# Altium schematic sheet Backplane.SchDoc
size A3
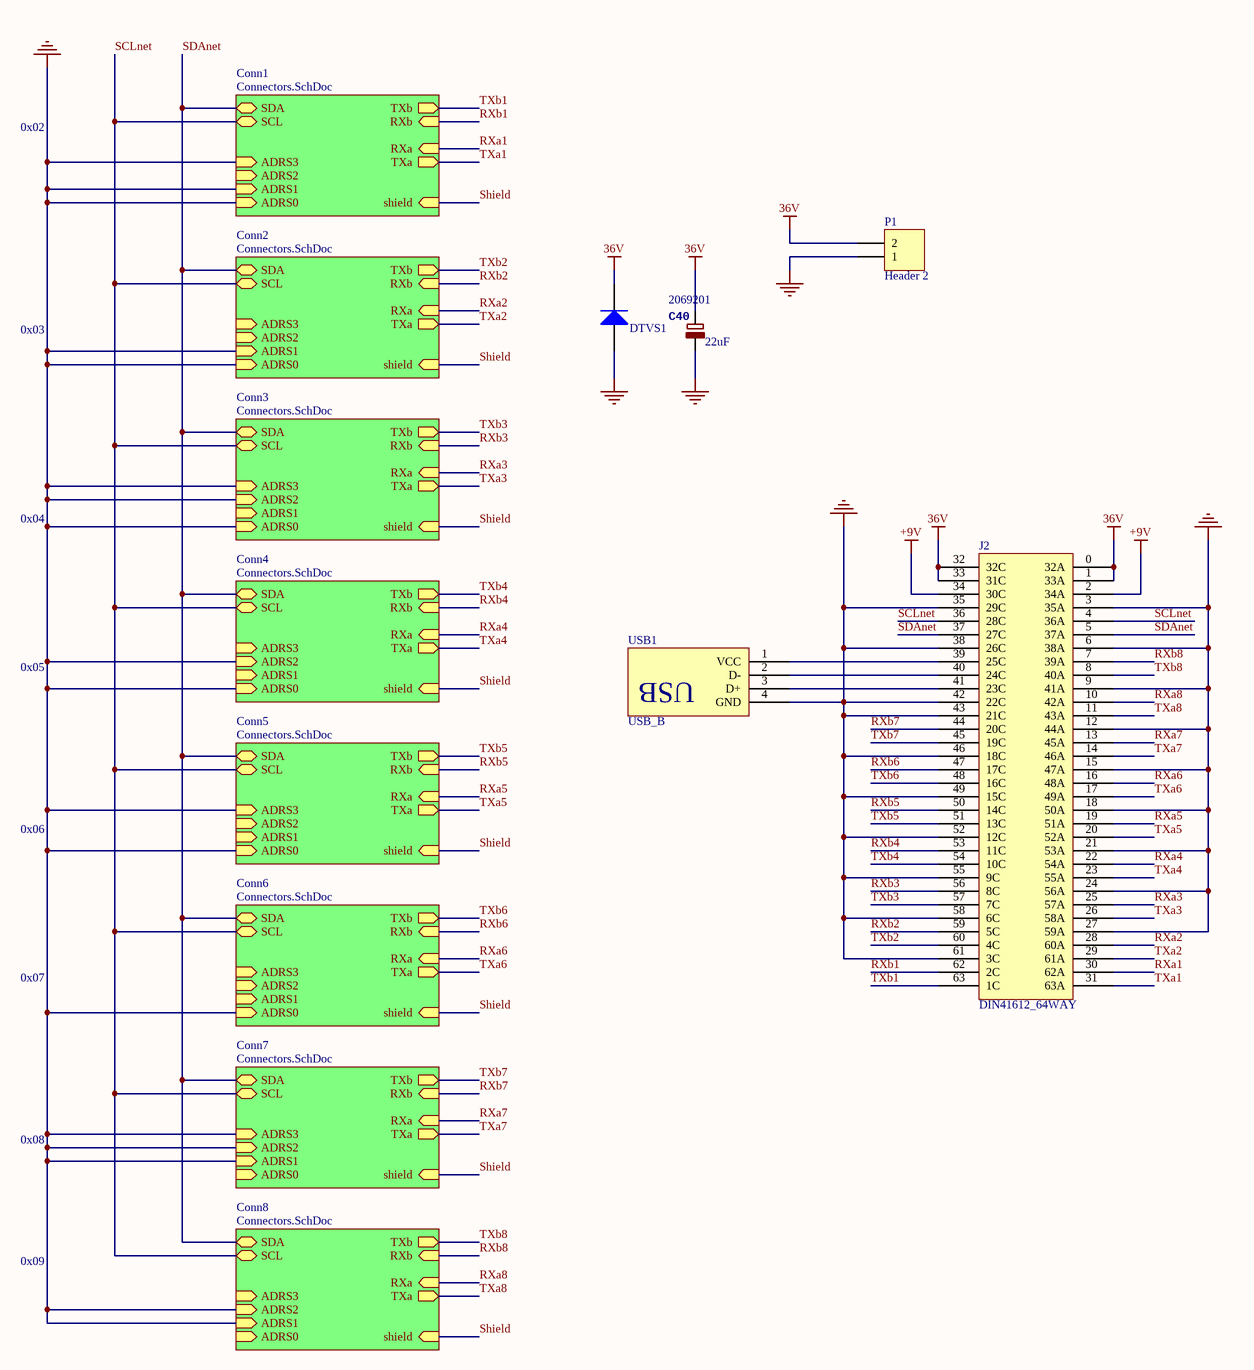
[diagram p0: Backplane.SchDoc]

## Parts
C40  value 22uF  Supplier Part Number 1: 2069201  [PANASONIC_D]
DTVS1  SMBJ36A  [SMBJ]  (value not drawn)
J2  DIN41612_64WAY  [09 03 164 6919]
P1  Header 2  [8PCV]
USB1  USB_B  [USB_B_VERTICAL]

## Sub-sheets
Conn1 = Connectors.SchDoc: SDA (bidir), SCL (bidir), RXb (in), TXb (out), RXa (in), TXa (out), ADRS3 (in), ADRS2 (in), ADRS1 (in), ADRS0 (in), shield (in)
Conn2 = Connectors.SchDoc: SDA (bidir), SCL (bidir), RXb (in), TXb (out), RXa (in), TXa (out), ADRS3 (in), ADRS2 (in), ADRS1 (in), ADRS0 (in), shield (in)
Conn3 = Connectors.SchDoc: SDA (bidir), SCL (bidir), RXb (in), TXb (out), RXa (in), TXa (out), ADRS3 (in), ADRS2 (in), ADRS1 (in), ADRS0 (in), shield (in)
Conn4 = Connectors.SchDoc: SDA (bidir), SCL (bidir), RXb (in), TXb (out), RXa (in), TXa (out), ADRS3 (in), ADRS2 (in), ADRS1 (in), ADRS0 (in), shield (in)
Conn5 = Connectors.SchDoc: SDA (bidir), SCL (bidir), RXb (in), TXb (out), RXa (in), TXa (out), ADRS3 (in), ADRS2 (in), ADRS1 (in), ADRS0 (in), shield (in)
Conn6 = Connectors.SchDoc: SDA (bidir), SCL (bidir), RXb (in), TXb (out), RXa (in), TXa (out), ADRS3 (in), ADRS2 (in), ADRS1 (in), ADRS0 (in), shield (in)
Conn7 = Connectors.SchDoc: SDA (bidir), SCL (bidir), RXb (in), TXb (out), RXa (in), TXa (out), ADRS3 (in), ADRS2 (in), ADRS1 (in), ADRS0 (in), shield (in)
Conn8 = Connectors.SchDoc: SDA (bidir), SCL (bidir), RXb (in), TXb (out), RXa (in), TXa (out), ADRS3 (in), ADRS2 (in), ADRS1 (in), ADRS0 (in), shield (in)

## Nets
36V: C40.1 DTVS1.1(K) J2.0(32A) J2.1(33A) J2.32(32C) J2.33(31C) P1.2
+9V: J2.2(34A) J2.34(30C)
GND: C40.2 DTVS1.2(A) J2.3(35A) J2.6(38A) J2.9(41A) J2.12(44A) J2.15(47A) J2.18(50A) J2.21(53A) J2.24(56A) J2.27(59A) J2.35(29C) J2.38(26C) J2.42(22C) J2.43(21C) J2.46(18C) J2.49(15C) J2.52(12C) J2.55(9C) J2.58(6C) J2.61(3C) P1.1 USB1.4(GND) ; sheet Conn1/ADRS3, sheet Conn1/ADRS1, sheet Conn1/ADRS0, sheet Conn2/ADRS1, sheet Conn2/ADRS0, sheet Conn3/ADRS3, sheet Conn3/ADRS2, sheet Conn3/ADRS0, sheet Conn4/ADRS2, sheet Conn4/ADRS0, sheet Conn5/ADRS3, sheet Conn5/ADRS0, sheet Conn6/ADRS0, sheet Conn7/ADRS3, sheet Conn7/ADRS2, sheet Conn7/ADRS1, sheet Conn8/ADRS2, sheet Conn8/ADRS1
RXa1: J2.30(62A) ; sheet Conn1/RXa
RXa2: J2.28(60A) ; sheet Conn2/RXa
RXa3: J2.25(57A) ; sheet Conn3/RXa
RXa4: J2.22(54A) ; sheet Conn4/RXa
RXa5: J2.19(51A) ; sheet Conn5/RXa
RXa6: J2.16(48A) ; sheet Conn6/RXa
RXa7: J2.13(45A) ; sheet Conn7/RXa
RXa8: J2.10(42A) ; sheet Conn8/RXa
RXb1: J2.62(2C) ; sheet Conn1/RXb
RXb2: J2.59(5C) ; sheet Conn2/RXb
RXb3: J2.56(8C) ; sheet Conn3/RXb
RXb4: J2.53(11C) ; sheet Conn4/RXb
RXb5: J2.50(14C) ; sheet Conn5/RXb
RXb6: J2.47(17C) ; sheet Conn6/RXb
RXb7: J2.44(20C) ; sheet Conn7/RXb
RXb8: J2.7(39A) ; sheet Conn8/RXb
SCLnet: J2.4(36A) J2.36(28C) ; sheet Conn1/SCL, sheet Conn2/SCL, sheet Conn3/SCL, sheet Conn4/SCL, sheet Conn5/SCL, sheet Conn6/SCL, sheet Conn7/SCL, sheet Conn8/SCL
SDAnet: J2.5(37A) J2.37(27C) ; sheet Conn1/SDA, sheet Conn2/SDA, sheet Conn3/SDA, sheet Conn4/SDA, sheet Conn5/SDA, sheet Conn6/SDA, sheet Conn7/SDA, sheet Conn8/SDA
Shield: sheet Conn1/shield, sheet Conn2/shield, sheet Conn3/shield, sheet Conn4/shield, sheet Conn5/shield, sheet Conn6/shield, sheet Conn7/shield, sheet Conn8/shield
TXa1: J2.31(63A) ; sheet Conn1/TXa
TXa2: J2.29(61A) ; sheet Conn2/TXa
TXa3: J2.26(58A) ; sheet Conn3/TXa
TXa4: J2.23(55A) ; sheet Conn4/TXa
TXa5: J2.20(52A) ; sheet Conn5/TXa
TXa6: J2.17(49A) ; sheet Conn6/TXa
TXa7: J2.14(46A) ; sheet Conn7/TXa
TXa8: J2.11(43A) ; sheet Conn8/TXa
TXb1: J2.63(1C) ; sheet Conn1/TXb
TXb2: J2.60(4C) ; sheet Conn2/TXb
TXb3: J2.57(7C) ; sheet Conn3/TXb
TXb4: J2.54(10C) ; sheet Conn4/TXb
TXb5: J2.51(13C) ; sheet Conn5/TXb
TXb6: J2.48(16C) ; sheet Conn6/TXb
TXb7: J2.45(19C) ; sheet Conn7/TXb
TXb8: J2.8(40A) ; sheet Conn8/TXb
NetJ2_39: J2.39(25C) USB1.1(VCC)
NetJ2_40: J2.40(24C) USB1.2(D-)
NetJ2_41: J2.41(23C) USB1.3(D+)

## Notes on the sheet
- 0x02
- 0x03
- 0x04
- 0x05
- 0x06
- 0x07
- 0x08
- 0x09
- (in symbol USB_B) USB

## Library data of the parts
C40 = CPOL-EUD: PartNo: EMZA500ADA220MF61G; Supplier 1: Farnell
DTVS1 = SMBJ: TVS; Note: Pin 2 is not connected and not drawn.; Published: 21-Mar-2003; LatestRevisionDate: 29-May-2009; LatestRevisionNote: IPC-7351 Footprint Added.; DatasheetVersion: Oct-1999; PackageVersion: Sep-2001; PackageReference: SOT-23; Publisher: Altium Limited; PackageDescription: 3-Pin SOT-23 Package 0.95 mm Pitch, 2.5 mm Lead Span; ComponentLink1Description: Manufacturer Link; ComponentLink1URL: http://www.infineon.com/; ComponentLink2Description: Datasheet; ComponentLink2URL: http://www.infineon.com/upload/Document/cmc_upload/documents/080/656/bas116series.pdf; PartNo: SMBJ36A
J2 = DIN41612_64WAY: PartNo: 9-1393640-3
P1 = Header 2: Header, 2-Pin; PartNo: 8PCV-02-006; LatestRevisionDate: 17-Jul-2002; LatestRevisionNote: Re-released for DXP Platform.; Publisher: Altium Limited